# EasyEDA Pro project 有刷电调.epro

# Schematic Schematic3
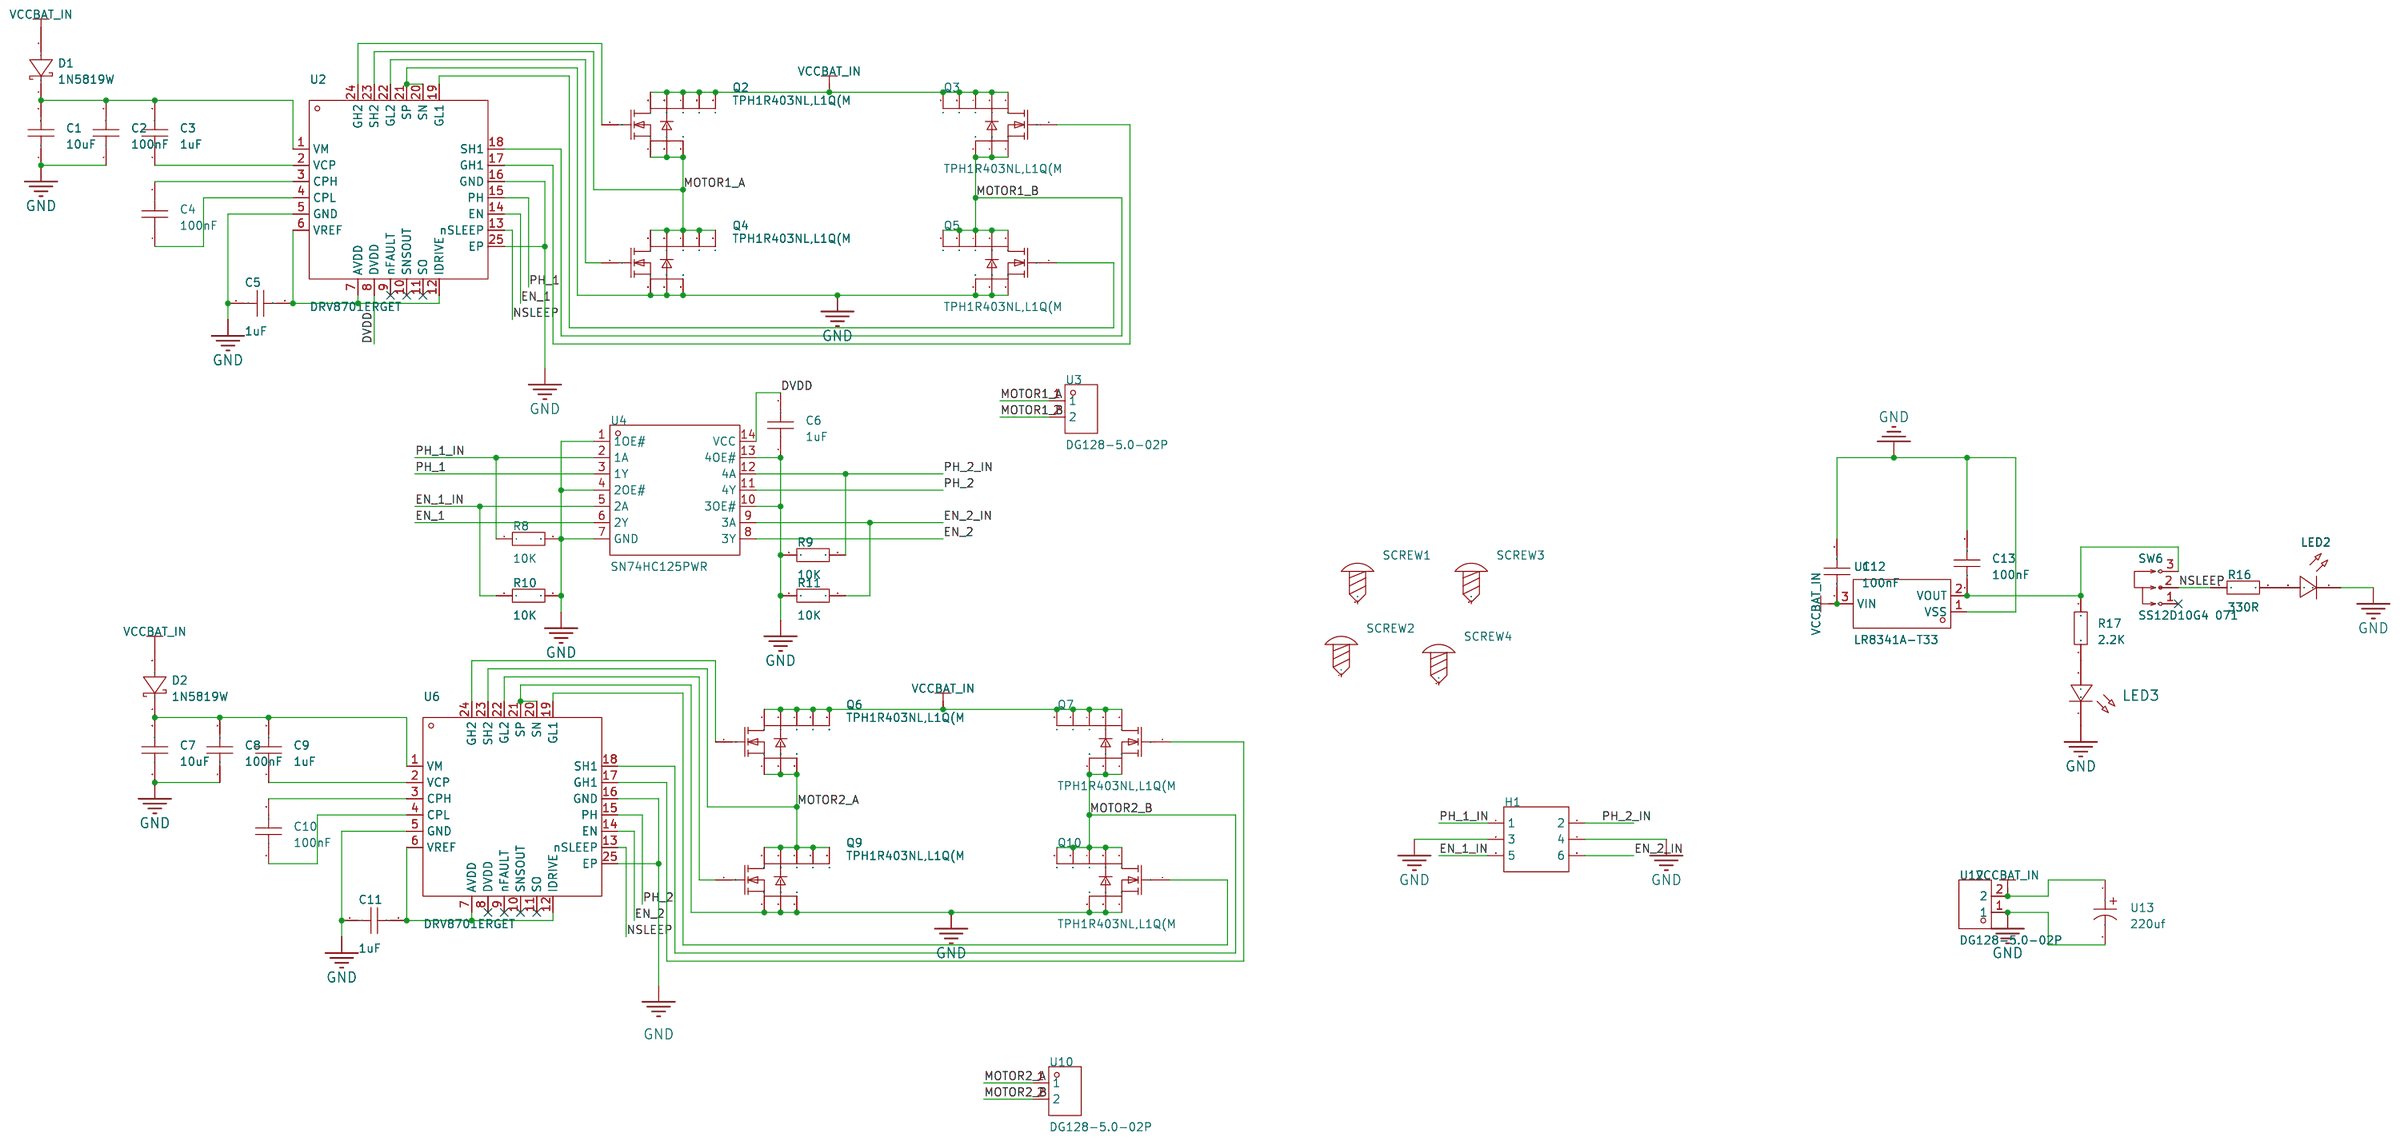
[diagram p0: schematic sheet]

## Parts
C1  10uF  [c0805]
C2  100nF  [C0603]
C3  1uF  [C0603]
C4  100nF  [C0603]
C5  1uF  [C0603]
C6  1uF  [C0603]
C7  10uF  [c0805]
C8  100nF  [C0603]
C9  1uF  [C0603]
C10  100nF  [C0603]
C11  1uF  [C0603]
C12  100nF  [C0603]
C13  100nF  [C0603]
D1  1N5819W  [SOD-123_L2.7-W1.6-LS3.7-RD-1]
D2  1N5819W  [SOD-123_L2.7-W1.6-LS3.7-RD-1]
H1  -  [HDR-TH_6P-P2.54-V-F-R2-C3-S2.54]
LED2  -  [LED_0603]
LED3  -  [LED_0603]
Q2  TPH1R403NL,L1Q(M  [DSOP-8_L5.0-W5.0-P1.27-LS6.0-BL-EP]
Q3  TPH1R403NL,L1Q(M  [DSOP-8_L5.0-W5.0-P1.27-LS6.0-BL-EP]
Q4  TPH1R403NL,L1Q(M  [DSOP-8_L5.0-W5.0-P1.27-LS6.0-BL-EP]
Q5  TPH1R403NL,L1Q(M  [DSOP-8_L5.0-W5.0-P1.27-LS6.0-BL-EP]
Q6  TPH1R403NL,L1Q(M  [DSOP-8_L5.0-W5.0-P1.27-LS6.0-BL-EP]
Q7  TPH1R403NL,L1Q(M  [DSOP-8_L5.0-W5.0-P1.27-LS6.0-BL-EP]
Q9  TPH1R403NL,L1Q(M  [DSOP-8_L5.0-W5.0-P1.27-LS6.0-BL-EP]
Q10  TPH1R403NL,L1Q(M  [DSOP-8_L5.0-W5.0-P1.27-LS6.0-BL-EP]
R8  10K  [R0603]
R9  10K  [R0603]
R10  10K  [R0603]
R11  10K  [R0603]
R16  330R  [R0603]
R17  2.2K  [R0603]
SCREW1  -  [M3螺丝]
SCREW2  -  [M3螺丝]
SCREW3  -  [M3螺丝]
SCREW4  -  [M3螺丝]
SW6  SS12D10G4 071  [SW-TH_SHOU-HAN_SS12D10G4]
U2  DRV8701ERGET  [VQFN-24_L4.0-W4.0-P0.50-BL-EP2.5]
U3  DG128-5.0-02P  [CONN-TH_XT30PW-M]
U4  SN74HC125PWR  [TSSOP-14_L5.0-W4.4-P0.65-LS6.5-BL]
U6  DRV8701ERGET  [VQFN-24_L4.0-W4.0-P0.50-BL-EP2.5]
U10  DG128-5.0-02P  [CONN-TH_XT30PW-M]
U11  LR8341A-T33  [SOT-23-3L_L2.9-W1.6-P1.90-LS2.8-BL]
U12  DG128-5.0-02P  [CONN-TH_XT30PW-M]
U13  220uf  [CAP-TH_BD6.3-P2.50-D0.5-FD]

## Library data of the parts
C1-C13 = CAP_0603: Supplier Footprint: 0603
D1 D2 = 1N5819W: 二极管配置:-;正向压降(Vf):900mV@3A;直流反向耐压(Vr):40V;平均整流电流(Io):1A;; LCSC Part Name: 电压:40V 电流:1A; Supplier Part: C2905650; Manufacturer: TECH PUBLIC(台舟); Supplier Footprint: SOD-123; JLCPCB Part Class: 扩展库; Datasheet: https://atta.szlcsc.com/upload/public/pdf/source/20211020/7FEA34DA99E5285CBA3CC87767B82BE7.pdf; Supplier: LCSC; Forward Voltage (Vf@If): 900mV@3A; Reverse Voltage (Vr): 40V; Average Rectified Current (Io): 1A; Reverse Leakage Current (Ir): 1mA@40V
H1 = HDR-F_2.54_2x3: Supplier Part: C92272; Supplier Footprint: 插件
LED2 = LED_0603-G: Supplier Footprint: 0603
LED3 = LED_0603-R: Supplier Footprint: 0603
Q2-Q7 Q9 Q10 = TPH1R403NL,L1Q(M: Supplier Part: C2940403; Manufacturer: TOSHIBA(东芝); Supplier Footprint: DFN-8(5x6); JLCPCB Part Class: 扩展库; Datasheet: https://atta.szlcsc.com/upload/public/pdf/source/20220830/C277A7BCA37DB7348B2C95BA2E6DA6BE.pdf; Supplier: LCSC
R8-R11 R16 R17 = Res_0603: Supplier Footprint: 0603
SCREW1-SCREW4 = M3螺丝: Supplier Footprint: 插件
SW6 = SS12D10G4 071: 电路结构:单刀双掷;安装方式:直插;开关颜色:-;额定电流(DC):2A;额定电压(DC):125V;额定电流(AC):-;额定电压(AC):-;机械寿命:3千次;; Supplier Part: C2887259; Manufacturer: SHOU HAN(首韩); Supplier Footprint: 插件; JLCPCB Part Class: 扩展库; Datasheet: https://atta.szlcsc.com/upload/public/pdf/source/20210820/80D1704BBF3FCEE0435FCAA54C61E0A3.pdf; Supplier: LCSC; Circuit: 单刀双掷; Pin Style: PC引脚; Switch Length: 12.7mm; Switch Width: 6.7mm; Switch Height: 6.4mm; Mounting Style: 直插; Current Rating (DC): 2A; Voltage Rating (DC): 125V; Mechanical Life: 3千次; Operating Temperature: -16℃~+60℃
U2 U6 = DRV8701ERGET: 驱动电机类型:有刷直流电机;电源电压:0V~5.5V;输出电流:-;接口:并行;; LCSC Part Name: 有刷直流电机驱动芯片 5.5V; Supplier Part: C132049; Manufacturer: TI(德州仪器); Supplier Footprint: VQFN-24(4x4); JLCPCB Part Class: 扩展库; Datasheet: https://www.ti.com/cn/lit/gpn/drv8701; Supplier: LCSC; Drive motor type: 有刷直流电机; Supply Voltage: 0V~5.5V; Interface: 并行; Operating Temperature: -40℃~+125℃@(Ta)
U3 U10 U12 = DG128-5.0-02P: 间距:5mm;排数:1;每排PIN数:2;安装方式:直针;额定电流:20A;额定电压:300V;线规 - AWG:12~30;线规 - mm?:2.5;工作温度范围:-40℃~+105℃;颜色:绿色;; LCSC Part Name: 5mm 排数:1 每排P数:2 直针; Manufacturer: DEGSON（高正/高松）; Manufacturer Part: DG128-5.0-02P-14-00A(H); Supplier Footprint: 直插,P=5mm; Datasheet: https://atta.szlcsc.com/upload/public/pdf/source/20200623/C691861_7A9C893F51DDD09CE6575068D5F90AE6.pdf; Supplier: LCSC-C711349; Pitch: 5mm; Number of Rows: 1; Number of PINs Per Row: 2; Mounting Style: 直针; Current Rating (Max): 20A; Voltage Rating (Max): 300V; Wire Gauge - AWG: 12~30; Wire Gauge - mm?: 2.5; Operating Temperature Range: -40℃~+105℃; Color: 绿色
U4 = SN74HC125PWR: 输入类型:-;电源电压:2V~6V;元件数:4;每个元件位数:1;灌电流(IOL):7.8mA;拉电流(IOH):7.8mA;; Supplier Part: C132994; Manufacturer: TI(德州仪器); Supplier Footprint: TSSOP-14; JLCPCB Part Class: 扩展库; Datasheet: https://www.ti.com/cn/lit/gpn/sn74hc125; Supplier: LCSC; output type: 三态; Supply Voltage: 2V~6V; Number of Elements: 4; Number of Bits per Element: 1; Sink Current: 7.8mA; Source Current: 7.8mA; Logic Family: 74HC; Operating Temperature: -40℃~+85℃
U11 = LR8341A-T33: 输出类型:固定;最大输入电压:40V;输出电压:3.3V;最大输出电流:100mA;电源纹波抑制比(PSRR):55dB@(1kHz);输出极性:正极;; LCSC Part Name: 输入40V 输出3.3V 100mA; Supplier Part: C2829465; Manufacturer: LR(朗瑞); Supplier Footprint: SOT-23-3L; JLCPCB Part Class: 扩展库; Datasheet: https://atta.szlcsc.com/upload/public/pdf/source/20210426/C2829465_61F15D7ACE9671B48D4F69A8092B0D8F.pdf; Supplier: LCSC; Output Type: 固定; Maximum Input Voltage: 40V; Output Voltage: 3.3V; MAX Output Current: 100mA; Power Supply Rejection Ratio (PSRR): 55dB@(1kHz); standby current: 2uA; Operating Temperature: -40℃~+85℃; Output Polarity: 正极; Number of Outputs: 1
U13 = 电解电容: Supplier Part: C9900022333; Supplier Footprint: CAP-TH; JLCPCB Part Class: 扩展库; Supplier: LCSC

## Nets
DVDD: C6.2 U2.8(DVDD) U4.14(VCC)
GND: C1.1 C2.1 C5.1 C6.1 C7.1 C8.1 C11.1 C12.2 C13.2 H1.3 H1.4 LED2.1(C) LED3.1(C) Q4.1(S) Q4.2(S) Q4.3(S) Q5.1(S) Q5.2(S) Q5.3(S) Q9.1(S) Q9.2(S) Q9.3(S) Q10.1(S) Q10.2(S) Q10.3(S) R8.2 R9.1 R10.2 R11.1 U2.5(GND) U2.16(GND) U2.20(SN) U2.21(SP) U2.25(EP) U4.1(1OE#) U4.4(2OE#) U4.7(GND) U4.10(3OE#) U4.13(4OE#) U6.5(GND) U6.16(GND) U6.20(SN) U6.21(SP) U6.25(EP) U11.1(VSS) U12.1 U13.2
VCCBAT_IN: C12.1 D1.2(A) D2.2(A) Q2.5(D) Q2.6(D) Q2.7(D) Q2.8(D) Q2.9(D) Q3.5(D) Q3.6(D) Q3.7(D) Q3.8(D) Q3.9(D) Q6.5(D) Q6.6(D) Q6.7(D) Q6.8(D) Q6.9(D) Q7.5(D) Q7.6(D) Q7.7(D) Q7.8(D) Q7.9(D) U11.3(VIN) U12.2 U13.1
EN_1: U2.14(EN) U4.6(2Y)
EN_1_IN: H1.5 R10.1 U4.5(2A)
EN_2: U4.8(3Y) U6.14(EN)
EN_2_IN: H1.6 R11.2 U4.9(3A)
MOTOR1_A: Q2.1(S) Q2.2(S) Q2.3(S) Q4.5(D) Q4.6(D) Q4.7(D) Q4.8(D) Q4.9(D) U2.23(SH2) U3.1
MOTOR1_B: Q3.1(S) Q3.2(S) Q3.3(S) Q5.5(D) Q5.6(D) Q5.7(D) Q5.8(D) Q5.9(D) U2.18(SH1) U3.2
MOTOR2_A: Q6.1(S) Q6.2(S) Q6.3(S) Q9.5(D) Q9.6(D) Q9.7(D) Q9.8(D) Q9.9(D) U6.23(SH2) U10.1
MOTOR2_B: Q7.1(S) Q7.2(S) Q7.3(S) Q10.5(D) Q10.6(D) Q10.7(D) Q10.8(D) Q10.9(D) U6.18(SH1) U10.2
NSLEEP: R16.1 SW6.2 U2.13(nSLEEP) U6.13(nSLEEP)
PH_1: U2.15(PH) U4.3(1Y)
PH_1_IN: H1.1 R8.1 U4.2(1A)
PH_2: U4.11(4Y) U6.15(PH)
PH_2_IN: H1.2 R9.2 U4.12(4A)
$1N1498: Q2.4(G) U2.24(GH2)
$1N1499: Q4.4(G) U2.22(GL2)
$1N1502: Q5.4(G) U2.19(GL1)
$1N1503: Q3.4(G) U2.17(GH1)
$1N1517: C5.2 U2.6(VREF) U2.7(AVDD) U2.12(IDRIVE)
$1N1519: C4.2 U2.3(CPH)
$1N1520: C4.1 U2.4(CPL)
$1N1521: C3.1 U2.2(VCP)
$1N1522: C1.2 C2.2 C3.2 D1.1(K) U2.1(VM)
$1N1525: Q6.4(G) U6.24(GH2)
$1N1526: Q9.4(G) U6.22(GL2)
$1N1529: Q10.4(G) U6.19(GL1)
$1N1530: Q7.4(G) U6.17(GH1)
$1N1542: C11.2 U6.6(VREF) U6.7(AVDD) U6.12(IDRIVE)
$1N1544: C10.2 U6.3(CPH)
$1N1545: C10.1 U6.4(CPL)
$1N1546: C9.1 U6.2(VCP)
$1N1547: C7.2 C8.2 C9.2 D2.1(K) U6.1(VM)
$1N1554: LED2.2(A) R16.2
$1N3369: C13.1 R17.2 SW6.3 U11.2(VOUT)
$1N3510: LED3.2(A) R17.1

Not connected (* = marked no-connect by the designer): SCREW1 1; SCREW2 1; SCREW3 1; SCREW4 1; SW6 1*; U2 9(nFAULT)* 10(SNSOUT)* 11(SO)*; U6 8(DVDD)* 9(nFAULT)* 10(SNSOUT)* 11(SO)*

# Board PCB3
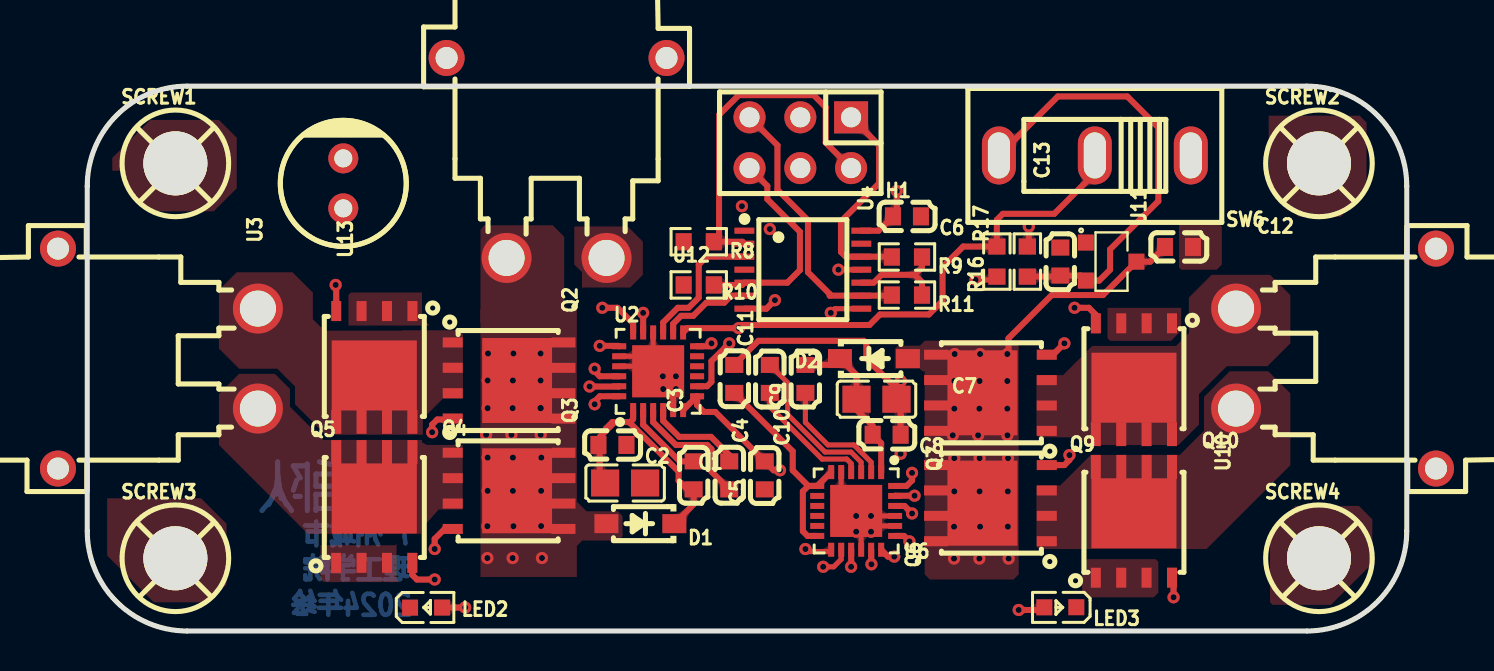
[diagram p1: board, top side]
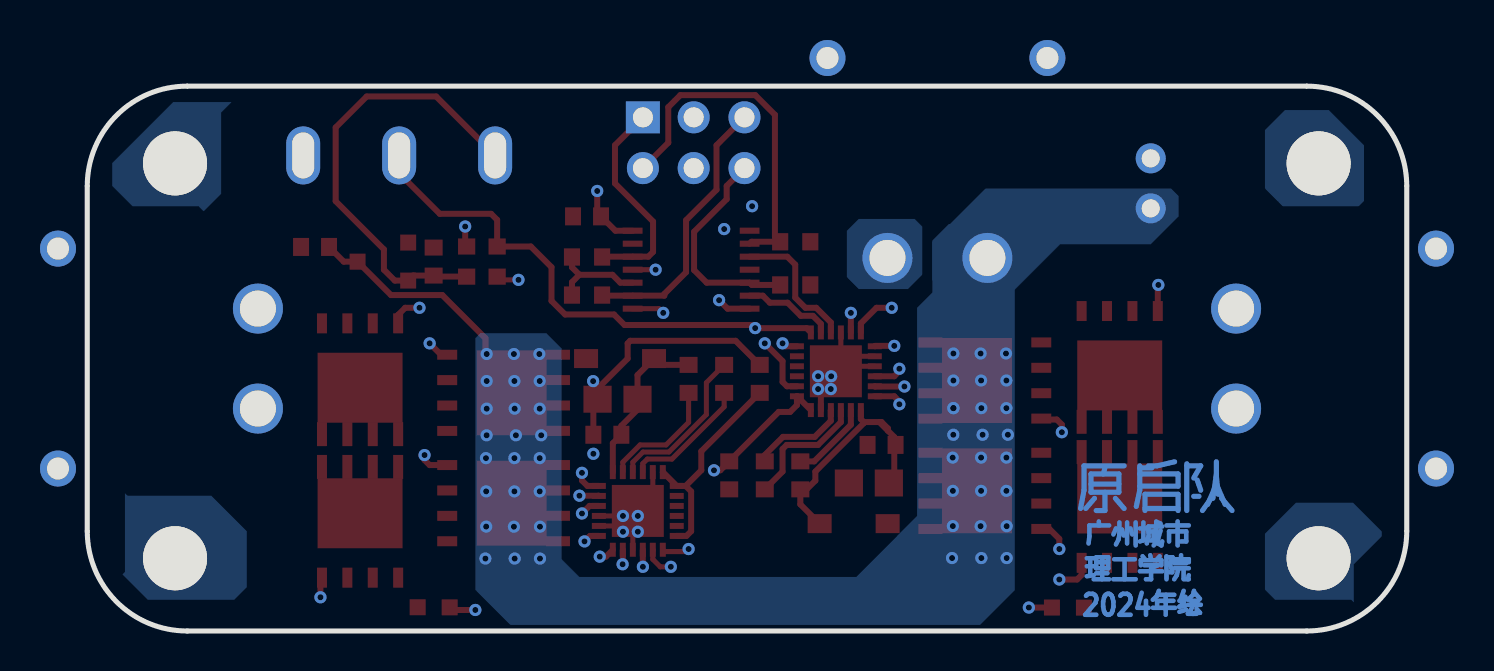
[diagram p2: board, bottom side, seen from below]

Outline 66 x 27.25 mm; copper layers: Top Layer, Inner1, Inner2, Bottom Layer. Coordinates in mm from the lower left corner of the outline.
Outline path: 0,22.25 0,5 arc(1.46,1.46) 5,0 61,0 arc(64.54,1.46) 66,5 66,22.25 arc(64.54,25.79) 61,27.25 5,27.25 arc(1.46,25.79) 0,22.25
Stack: Top Layer 0.035mm 外层铜厚1oz / Dielectric1 0.2104mm 7628 RC49% 8.6mil / Inner1 0.0152mm 内层铜厚 / Dielectric2 1.065mm 1.1mm H/HOZ 含铜 / Inner2 0.0152mm 内层铜厚 / Dielectric3 0.2104mm 7628 RC49% 8.6mil / Bottom Layer 0.035mm 外层铜厚1oz

## Design rules (mm)
template: JLCPCB Capability(Two Layers Board)
spacing copperThickness1oz (default): track to track 0.102, other pairs 0.152 to 0.3
spacing copperThickness2oz: track to track 0.203, other pairs 0.152 to 0.3
track width copperThickness1oz (default): min 0.127, default 0.254, max 2.54
track width copperThickness2oz: min 0.203, default 0.254, max 2.54
differential pair differentialPair (default): width min 0.127, default 0.254, max 2.54; gap min 0.152, default 0.152
via viaSize (default): diameter min 0.5, default 0.61, max 10; hole min 0.3, default 0.305, max 6.3

## Placement (name value [footprint] x y rotation side)
C1  10uF  [c0805]  26.9 7.4 180 top
C2  100nF  [C0603]  26.27 9.31 180 top
C3  1uF  [C0603]  30.33 7.78 270 top
C4  100nF  [C0603]  32.11 7.78 270 top
C5  1uF  [C0603]  33.89 7.78 90 top
C6  1uF  [C0603]  41 20.74 180 top
C7  10uF  [c0805]  39.48 11.59 180 top
C8  100nF  [C0603]  39.99 9.81 180 top
C9  1uF  [C0603]  35.92 12.61 90 top
C10  100nF  [C0603]  34.14 12.61 90 top
C11  1uF  [C0603]  32.37 12.61 270 top
C12  100nF  [C0603]  54.61 19.21 0 top
C13  100nF  [C0603]  48.67 18.48 90 top
D1  1N5819W  [SOD-123_L2.7-W1.6-LS3.7-RD-1]  27.67 5.37 180 top
D2  1N5819W  [SOD-123_L2.7-W1.6-LS3.7-RD-1]  39.35 13.62 0 top
H1  -  [HDR-TH_6P-P2.54-V-F-R2-C3-S2.54]  35.67 24.42 180 top
LED2  -  [LED_0603]  17 1.18 0 top
LED3  -  [LED_0603]  48.62 1.18 180 top
Q2  TPH1R403NL,L1Q(M  [DSOP-8_L5.0-W5.0-P1.27-LS6.0-BL-EP]  21.05 12.53 270 top
Q3  TPH1R403NL,L1Q(M  [DSOP-8_L5.0-W5.0-P1.27-LS6.0-BL-EP]  21.05 7.01 270 top
Q4  TPH1R403NL,L1Q(M  [DSOP-8_L5.0-W5.0-P1.27-LS6.0-BL-EP]  14.36 13.23 180 top
Q5  TPH1R403NL,L1Q(M  [DSOP-8_L5.0-W5.0-P1.27-LS6.0-BL-EP]  14.36 6.18 0 top
Q6  TPH1R403NL,L1Q(M  [DSOP-8_L5.0-W5.0-P1.27-LS6.0-BL-EP]  45.22 6.39 90 top
Q7  TPH1R403NL,L1Q(M  [DSOP-8_L5.0-W5.0-P1.27-LS6.0-BL-EP]  45.22 11.91 90 top
Q9  TPH1R403NL,L1Q(M  [DSOP-8_L5.0-W5.0-P1.27-LS6.0-BL-EP]  52.35 5.44 0 top
Q10  TPH1R403NL,L1Q(M  [DSOP-8_L5.0-W5.0-P1.27-LS6.0-BL-EP]  52.35 12.62 180 top
R8  10K  [R0603]  30.59 19.47 180 top
R9  10K  [R0603]  41 18.7 180 top
R10  10K  [R0603]  30.59 17.31 180 top
R11  10K  [R0603]  41 16.8 180 top
R16  330R  [R0603]  45.5 18.48 270 top
R17  2.2K  [R0603]  47.02 18.48 270 top
SCREW1  -  [M3螺丝]  4.47 23.32 0 top
SCREW2  -  [M3螺丝]  61.67 23.32 0 top
SCREW3  -  [M3螺丝]  4.47 3.57 0 top
SCREW4  -  [M3螺丝]  61.67 3.57 0 top
SW6  SS12D10G4 071  [SW-TH_SHOU-HAN_SS12D10G4]  50.4 23.78 180 top
U2  DRV8701ERGET  [VQFN-24_L4.0-W4.0-P0.50-BL-EP2.5]  28.56 12.99 0 top
U3  DG128-5.0-02P  [CONN-TH_XT30PW-M]  3.54 13.62 270 top
U4  SN74HC125PWR  [TSSOP-14_L5.0-W4.4-P0.65-LS6.5-BL]  35.79 18.07 270 top
U6  DRV8701ERGET  [VQFN-24_L4.0-W4.0-P0.50-BL-EP2.5]  38.46 6 180 top
U10  DG128-5.0-02P  [CONN-TH_XT30PW-M]  62.46 13.62 90 top
U11  LR8341A-T33  [SOT-23-3L_L2.9-W1.6-P1.90-LS2.8-BL]  51.21 18.48 270 top
U12  DG128-5.0-02P  [CONN-TH_XT30PW-M]  23.47 23.66 180 top
U13  220uf  [CAP-TH_BD6.3-P2.50-D0.5-FD]  12.81 22.39 90 top

## Footprints (pads in the part's own frame, mm; a bottom-side part is the same pattern mirrored in y, then rotated)
C0603
  rect 0.8x0.9 smd: 1(-0.7,0) 2(0.7,0)
c0805
  rect 1.41x1.35 smd: 1(-1,0) 2(1,0)
CAP-TH_BD6.3-P2.50-D0.5-FD
  round 1.5 hole 0.9: 1(-1.25,0) 2(1.25,0)
CONN-TH_XT30PW-M
  round 2.5 hole 1.8: 1(-2.5,5) 2(2.5,5)
  round 1.8 hole 1.1: 3(5.5,-5) 4(-5.5,-5)
DSOP-8_L5.0-W5.0-P1.27-LS6.0-BL-EP
  rect 0.5x1 smd: 1(-1.905,-2.77) 2(-0.635,-2.77) 3(0.634,-2.77) 4(1.905,-2.77)
  rect 0.5x1.2 smd: 5(1.905,2.77) 6(0.635,2.77) 7(-0.634,2.77) 8(-1.905,2.77)
  custom 4.25x3.5 smd: 9(0,0.45)
HDR-TH_6P-P2.54-V-F-R2-C3-S2.54
  rect 1.7x1.6 hole 1: 1(-2.54,-1.27)
  round 1.6 hole 1: 2(-2.54,1.27) 3(0,-1.27) 4(0,1.27) 5(2.54,-1.27) 6(2.54,1.27)
LED_0603
  rect 0.8x0.8 smd: 1(-0.851,-0.01) 2(0.75,-0.005)
M3螺丝
  round 3.2 hole 3.2: 1(-0.064,0.064)
R0603
  rect 0.806x0.864 smd: 1(-0.753,0) 2(0.753,0)
SOD-123_L2.7-W1.6-LS3.7-RD-1
  rect 1.2x0.95 smd: 1(-1.7,0) 2(1.7,0)
SOT-23-3L_L2.9-W1.6-P1.90-LS2.8-BL
  rect 0.8x0.8 smd: 1(-0.95,-1.265) 2(0.95,-1.265) 3(0.005,1.265)
SW-TH_SHOU-HAN_SS12D10G4
  oval 1.7x2.9 hole 1.1x2.3: 1(-4.8,0) 2(0,0) 3(4.8,0)
TSSOP-14_L5.0-W4.4-P0.65-LS6.5-BL
  rect 0.305x0.991 smd: 1(-1.95,-2.925) 2(-1.3,-2.925) 3(-0.65,-2.925) 4(0,-2.925) 5(0.65,-2.925) 6(1.3,-2.925) 7(1.95,-2.925) 8(1.95,2.925) 9(1.3,2.925) 10(0.65,2.925) 11(0,2.925) 12(-0.65,2.925) 13(-1.3,2.925) 14(-1.95,2.925)
VQFN-24_L4.0-W4.0-P0.50-BL-EP2.5
  rect 0.3x0.7 smd: 1(-1.25,-1.942) 2(-0.75,-1.942) 3(-0.25,-1.942) 4(0.25,-1.942) 5(0.75,-1.942) 6(1.25,-1.942) 13(1.25,1.942) 14(0.75,1.942) 15(0.25,1.942) 16(-0.25,1.942) 17(-0.75,1.942) 18(-1.25,1.942)
  rect 0.7x0.3 smd: 7(1.948,-1.25) 8(1.948,-0.75) 9(1.948,-0.25) 10(1.948,0.25) 11(1.948,0.75) 12(1.948,1.25) 19(-1.948,1.25) 20(-1.948,0.75) 21(-1.948,0.25) 22(-1.948,-0.25) 23(-1.948,-0.75) 24(-1.948,-1.25)
  rect 2.6x2.6 smd: 25(0.001,-0.001)

## Nets
As in the schematic, except:
GND: C1.1 C2.1 C5.1 C6.1 C7.1 C8.1 C11.1 C12.2 C13.2 H1.3 H1.4 LED2.1 LED3.1 Q4.1 Q4.2 Q4.3 Q5.1 Q5.2 Q5.3 Q9.1 Q9.2 Q9.3 Q10.1 Q10.2 Q10.3 R8.2 R9.1 R10.2 R11.1 SCREW1.1 SCREW2.1 SCREW3.1 SCREW4.1 U2.5 U2.16 U2.20 U2.21 U2.25 U4.1 U4.4 U4.7 U4.10 U4.13 U6.5 U6.16 U6.20 U6.21 U6.25 U11.1 U12.1 U13.2
EN_1_IN: H1.6 R10.1 U4.5
EN_2_IN: H1.5 R11.2 U4.9
PH_1_IN: H1.2 R8.1 U4.2
PH_2_IN: H1.1 R9.2 U4.12

Pads without a net: SW6 1; U2 9 10 11; U3 3 4; U6 8 9 10 11; U10 3 4; U12 3 4

## Via types
v1: diameter 0.61, hole 0.305, Top Layer to Bottom Layer, 96 vias

## Routing (per net, layer and track width the routed paths; a pad name or vN(x,y) marks a point on that pad's centre or on a via; arc(x,y) is an arc through that point)
DVDD: length 19.9
  Top Layer w0.3: U4.14 39.58,20.02 40.49,20.93 v1(40.49,22.01) ; U2.8 31,12.24 31.22,12.46 31.22,13.5 v1(32.11,14.39)
  Inner1 w0.3: v1(32.11,14.39) 31.6,14.89 31.6,15.91 35.79,20.1 39.35,20.1 40.49,21.25 v1(40.49,22.01)
GND: length 35
  Top Layer w0.254: 38.71,5.75 U6.25 37.71,6.75 U6.5 ; 38.71,5.75 v1(39.2,5.75) 40.41,5.75 ; 38.71,5.75 39.21,5.25 40.41,5.25 ; 38.71,5.75 U6.16 ; U2.20 27.81,13.74 28.31,13.24 ; 28.31,13.24 U2.25 ; 28.31,13.24 28.31,14.93 ; 28.31,13.24 U2.21
  Top Layer w0.3: C8.1 40.69,11.39 C7.1 40.48,12.12 38.97,13.62 38.97,14.39 38.84,14.51 33.57,14.51 C11.1 ; U2.5 29.31,12.24 U2.25 ; 32.87,16.12 33.97,16.12 v1(34.4,16.55) ; R9.1 41.75,18.19 41.38,17.82 ; 41.38,17.82 39.73,17.82 39.34,17.42 38.72,17.42 ; 41.38,17.82 41.75,17.44 R11.1
  vias: v1(28.79,12.74) v1(28.81,12.1) v1(29.44,12.74) v1(29.44,12.1) v1(32.75,21.25) v1(34.14,20.1) v1(38.46,5.75) v1(38.46,4.97) v1(39.2,4.97) v1(40.7,12.5) v1(40.69,8.86)
VCCBAT_IN: length 13
  Top Layer w0.3: Q7.9 46.08,13.22 46.08,14.64 48.24,16.8 50.81,16.8 U11.3 53.17,18.47 C12.1
  vias: v1(20.05,13.88) v1(20.03,12.53) v1(20.03,11.15) v1(19.95,9.81) v1(20.03,8.67) v1(20.03,7.01) v1(20.01,5.24) v1(20.01,3.65) v1(21.22,9.81) v1(21.32,13.88) v1(21.29,12.53) v1(21.28,11.15) v1(21.29,8.67) v1(21.29,7.01) v1(21.32,5.24) v1(21.28,3.65) v1(22.68,13.88) v1(22.68,12.53) v1(22.68,11.15) v1(22.68,11.15) v1(22.68,9.81) v1(22.71,8.67) v1(22.7,7.01) v1(22.7,5.25) v1(22.74,3.65) v1(43.29,9.79) v1(43.39,13.85) v1(43.37,12.5) v1(43.37,11.12) v1(43.37,8.65) v1(43.37,6.98) v1(43.36,5.22) v1(43.36,3.62) v1(44.63,12.5) v1(44.62,11.12) v1(44.56,9.79) v1(44.63,8.65) v1(44.63,6.98) v1(44.62,3.62) v1(44.66,13.85) v1(44.66,5.22) v1(46.02,13.85) v1(46.02,12.5) v1(46.02,11.12) v1(46.02,9.79) v1(46.05,6.98) v1(46.05,5.22) v1(46.06,8.65) v1(46.09,3.62)
EN_1: length 4.6
  Top Layer w0.3: U4.6 32.21,16.77 31.86,16.42 30.97,16.42 30.31,15.76 29.7,15.76 29.31,15.36 29.31,14.93
EN_1_IN: length 10.8
  Top Layer w0.3: H1.6 34.02,22.26 34.02,21.6 35.65,19.97 35.65,18.05 35.02,17.42 32.87,17.42 32.76,17.31 R10.1
EN_2: length 16.3
  Top Layer w0.254: 38.72,16.12 37.4,16.12 v1(37.19,15.91) ; 37.7,4.05 U6.14 37.71,3.59 37.34,3.21 v1(36.81,3.21)
  Inner1 w0.254: v1(37.19,15.91) 36.51,15.23 36.51,3.52 v1(36.81,3.21)
EN_2_IN: length 13.7
  Top Layer w0.3: R11.2 40.22,16.77 U4.9 37.14,16.77 37.14,16.86 36.05,17.94 36.05,20.54 34.52,22.07 34.52,24.29 H1.5
MOTOR1_A: length 32.1
  Top Layer w0.3: U2.23 26.59,12.23 v1(25.13,12.23)
  Inner2 w0.5: v1(25.13,12.23) 24.36,12.99 24.36,14.72 24.06,15.02 18.65,15.02 12.68,9.05 7.4,9.05 6.58,9.87 6.58,14.17 U3.1
MOTOR1_B: length 21.6
  Top Layer w0.3: v1(25.76,16.17) 26.52,16.17 27.31,15.38 27.31,14.93
  Inner2 w0.5: v1(25.76,16.17) 16.62,16.17 11.58,11.12 U3.2
MOTOR2_A: length 39.6
  Top Layer w0.3: 40.41,6.75 40.42,6.77 v1(41.38,6.77)
  Inner2 w0.5: U10.1 57.63,10.96 58.62,10.96 59.12,11.46 59.12,17.28 58.62,17.78 56.78,17.78 55,16 55,10.36 47.35,2.7 42.53,2.7 42.14,3.08 42.14,6 v1(41.38,6.77)
MOTOR2_B: length 26.9
  Top Layer w0.3: U6.18 40.06,3.72 v1(40.37,3.72)
  Inner2 w0.5: U10.2 55.61,14.27 55.61,10.11 47.44,1.94 42.14,1.94 v1(40.37,3.72)
NSLEEP: length 40.3
  Top Layer w0.254: U6.13 37.12,3.97 36.05,3.97
  Top Layer w0.3: 29.81,14.93 30.02,15.15 v1(32.59,15.15) 32.75,15.3 39.12,15.3 39.65,15.83 42.1,15.83 42.78,16.51 42.78,18.2 43.81,19.23 R16.1 45.5,20.56 45.8,20.86 48.37,20.86 50.4,22.9 SW6.2
  Inner1 w0.254: 32.49,15.15 32.62,15.15 35.92,11.85 v1(35.92,4.1)
PH_1: length 6.9
  Top Layer w0.3: 28.81,14.93 28.81,15.43 29.54,16.17 30.08,16.17 30.59,16.67 30.59,18.32 30.98,18.72 U4.3
PH_1_IN: length 17.6
  Top Layer w0.3: H1.2 36.94,24.42 36.94,26.2 36.34,26.8 32.59,26.8 31.6,25.82 31.6,19.73 R8.1 32.77,19.47 U4.2
PH_2: length 17.9
  Top Layer w0.254: U4.11 v1(37.57,18.07)
  Top Layer w0.3: v1(38.21,3.21) 38.21,3.22 U6.15
  Inner1 w0.254: v1(37.57,18.07) 37.83,17.82 37.83,15.26 36.94,14.37 36.94,4.48 v1(38.21,3.21)
PH_2_IN: length 10.8
  Top Layer w0.3: H1.1 39.6,24.29 39.6,22.39 37.7,20.48 37.7,18.96 37.94,18.72 U4.12 40.23,18.72 R9.2
$1N1498: length 37.8
  Top Layer w0.3: v1(17.25,9.94) 17.25,10.32 17.51,10.58 18.23,10.58 18.28,10.62 ; v1(25.38,11.34) 25.38,11.49 25.63,11.74 U2.24
  Inner1 w0.3: v1(25.38,11.34) 25.38,11.62 29.21,15.45 29.21,20.21 27.03,22.39 19.54,22.39 18.05,20.9 18.05,10.16 17.83,9.94 v1(17.25,9.94)
$1N1499: length 45.5
  Top Layer w0.3: U2.22 25.63,12.74 25.38,12.99 v1(25.38,13.12) ; v1(12.43,17.31) 12.45,17.28 12.45,16
  Inner1 w0.3: v1(12.43,17.31) 16.49,13.24 16.49,9.84 17.16,9.18 17.63,9.18 18.45,10 18.45,20.73 19.7,21.99 26.87,21.99 28.81,20.04 28.81,16.06 25.87,13.12 v1(25.38,13.12)
$1N1502: length 37.5
  Top Layer w0.3: Q5.4 16.26,2.8 16.49,2.58 v1(17.38,2.58) ; U2.19 26.59,14.26 v1(25.63,14.26)
  Inner1 w0.3: v1(25.63,14.26) 25.63,14.68 28.01,17.06 28.01,19.71 26.53,21.18 20.04,21.18 19.25,20.4 19.25,4.45 v1(17.38,2.58)
$1N1503: length 34.6
  Top Layer w0.3: v1(17.38,4.1) 17.38,4.61 17.88,5.11 18.28,5.11 ; 27.81,14.93 v1(27.81,15.91)
  Inner1 w0.3: v1(27.81,15.91) 28.41,16.51 28.41,19.88 26.7,21.59 19.87,21.59 18.85,20.56 18.85,9.83 17.38,8.36 v1(17.38,4.1)
$1N1517: length 15.6
  Top Layer w0.3: U2.6 30.5,11.74 U2.7 30.5,11.3 30.84,10.96 31.41,10.96 C5.2 34.34,8.04 v1(34.65,8.04) ; v1(31.22,14.39) 31.07,14.24 U2.12
  Inner1 w0.3: v1(34.65,8.04) 34.4,8.04 31.22,11.21 v1(31.22,14.39)
$1N1519: length 6.5
  Top Layer w0.3: C4.2 31.22,7.97 31.22,9.1 31.01,9.31 29.44,9.31 28.31,10.45 U2.3
$1N1520: length 4.9
  Top Layer w0.3: C4.1 32.11,8.8 31.2,9.71 29.61,9.71 28.81,10.51 28.81,11.04 U2.4
$1N1521: length 4
  Top Layer w0.3: U2.2 27.81,10.32 29.64,8.48 C3.1
$1N1522: length 12.8
  Top Layer w0.3: 25.95,10.02 26.38,10.45 ; 25.95,10.02 25.95,10.13 26.27,10.45 26.38,10.45 ; 25.95,10.02 25.63,9.7 25.63,7.66 25.89,7.4 26.16,7.4 ; 26.38,10.45 27.16,10.45 ; D1.1 30.33,6.34 C3.2 30.02,7.08 29.58,7.52 29.58,7.97 27.16,10.4 27.16,10.45 ; 27.16,10.45 27.31,10.6 U2.1
$1N1525: length 26.5
  Top Layer w0.3: v1(41.25,7.91) 41.25,7.53 40.98,7.25 40.41,7.25 ; v1(49.13,8.8) 49.13,8.55 48.88,8.3 Q6.4
  Inner1 w0.3: v1(41.25,7.91) 39.5,7.91 38.52,8.89 38.52,12.24 41.85,15.57 46.42,15.57 47.88,14.12 47.88,10.34 49.13,9.09 v1(49.13,8.8)
$1N1526: length 39
  Top Layer w0.3: v1(54.34,1.69) 54.34,2.59 Q9.4 ; v1(41.25,5.88) 40.88,6.25 40.41,6.25
  Inner1 w0.3: v1(54.34,1.69) 51.67,1.69 49.76,3.59 49.76,9.02 48.28,10.51 48.28,14.28 46.59,15.97 41.69,15.97 38.12,12.4 38.12,8.72 40.96,5.88 v1(41.25,5.88)
$1N1529: length 25.3
  Top Layer w0.3: v1(41.13,4.48) 40.85,4.75 40.41,4.75 ; Q10.4 50.45,15.81 50.1,16.17 v1(49.38,16.17)
  Inner1 w0.3: v1(49.38,16.17) 49.18,16.37 41.52,16.37 37.72,12.57 37.72,8.56 41.13,5.15 v1(41.13,4.48)
$1N1530: length 29.2
  Top Layer w0.3: v1(48.88,14.39) 48.31,13.82 Q7.4 ; v1(39.22,3.34) 39.21,3.35 U6.17
  Inner1 w0.3: v1(48.88,14.39) 49.99,15.5 49.99,16.42 49.63,16.77 41.35,16.77 37.32,12.73 37.32,4.96 38.94,3.34 v1(39.22,3.34)
$1N1542: length 10.8
  Top Layer w0.3: U6.12 36.03,4.75 35.79,4.99 35.79,6.98 36.07,7.25 ; 36.07,7.25 U6.7 37.2,7.95 U6.6 ; 36.07,7.25 35.29,8.04 35.29,8.99 C11.2
$1N1544: length 8
  Top Layer w0.25: C10.2 35.03,12.42 35.03,10.82 36.9,8.95 38.2,8.95 38.71,8.44 U6.3
$1N1545: length 6.4
  Top Layer w0.254: C10.1 34.14,11.21 36.76,8.6 37.99,8.6 38.21,8.37 U6.4
$1N1546: length 6.1
  Top Layer w0.254: U6.2 39.21,8.44 38.35,9.31 37.05,9.31 35.92,10.43 C9.1
$1N1547: length 8.4
  Top Layer w0.25: D2.1 37.33,13.31
  Top Layer w0.3: D2.1 38.48,12.8 C7.2 38.48,11.07 39.28,10.26 39.28,9.81 39.71,9.39 U6.1 ; 37.33,13.31 C9.2
$1N1554: length 34.6
  Top Layer w0.254: R16.2 45.34,17.56 v1(44.43,17.56)
  Top Layer w0.3: LED2.2 v1(18.9,1.17)
  Inner2 w0.3: v1(44.43,17.56) 40.24,17.56 23.85,1.17 v1(18.9,1.17)
$1N3369: length 22.4
  Top Layer w0.3: SW6.3 48.55,26.73 52.02,26.73 53.57,25.18 53.57,21.5 51.16,19.09 51.16,18.07 50.62,17.53 U11.2 49.7,17.78 C13.1 48.62,17.72 R17.2
$1N3510: length 42
  Top Layer w0.3: LED3.2 47.74,1.05 v1(46.59,1.05) ; R17.1 47.1,19.3 v1(47.1,20.23) 46.97,20.36
  Inner2 w0.3: v1(46.59,1.05) 36.68,1.05 33,4.73 33,8.29 40.75,16.04 45.8,16.04 47.1,17.33 v1(47.1,20.23)

## Copper pours and planes (outline as drawn; the poured copper is in the pictures)
GND on Top Layer: 24.35,20.23 27.79,20.23 27.79,17.18 24.35,17.18
GND on Top Layer: 13.06,16.93 17.12,16.93 17.12,15.28 13.06,15.28
GND on Top Layer: 59.16,6.26 64.28,6.26 64.28,1.31 59.16,1.31
GND on Top Layer: 59.1,25.77 64.12,25.77 64.12,20.72 59.1,20.72
GND on Top Layer: 54.61,20.44 56.75,20.44 56.75,18.07 54.61,18.07
GND on Top Layer: 1.25,25.56 7.47,25.56 7.47,20.99 1.25,20.99
GND on Top Layer: 49.76,3.59 53.57,3.59 53.57,1.69 49.76,1.69
GND on Top Layer: 1,6.64 6.97,6.64 6.97,1.43 1,1.43
GND on Top Layer: 51.03,16.17 54.72,16.17 54.72,14.51 51.03,14.51
GND on Top Layer: 11.66,4.35 15.6,4.35 15.6,2.45 11.66,2.45
GND on Top Layer: -15.51,38.52 79.35,38.52 79.35,-11.01 -15.51,-11.01
GND on Bottom Layer: 58.02,6.89 64.24,6.89 64.24,1.56 58.02,1.56
GND on Bottom Layer: 1.25,6.42 7.09,6.42 7.09,1.43 1.25,1.43
GND on Bottom Layer: 58.78,26.45 64.75,26.45 64.75,20.99 58.78,20.99
GND on Bottom Layer: 24.24,20.61 28.01,20.61 28.01,17.1 24.24,17.1
GND on Bottom Layer: 2.14,26.05 7.09,26.05 7.09,21.25 2.14,21.25
GND on Bottom Layer: -10.05,34.83 75.29,34.83 75.29,-6.69 -10.05,-6.69
GND on Inner1: -17.17,41.56 92.06,41.56 92.06,-14.7 -17.17,-14.7
GND on Inner2: -22.75,45.12 101.96,45.12 101.96,-21.3 -22.75,-21.3
VCCBAT_IN on Top Layer: 40.39,14.51 43.06,14.51 43.06,12.99 40.39,12.99
VCCBAT_IN on Top Layer: 19.66,16.09 26.78,16.09 26.78,2.7 19.66,2.7
VCCBAT_IN on Top Layer: 41.89,14.51 46.59,14.51 46.59,2.58 41.89,2.58
VCCBAT_IN on Top Layer: 19.66,20.29 24.49,20.29 24.49,15.4 19.66,15.4
VCCBAT_IN on Bottom Layer: 19.61,20.36 46.59,20.36 46.59,0.31 19.61,0.31
VCCBAT_IN on Bottom Layer: 11.41,22.13 23.73,22.13 23.73,16.8 11.41,16.8
MOTOR1_A on Top Layer: 15.78,15.04 18.79,15.04 18.79,9.94 15.78,9.94
MOTOR1_A on Top Layer: 6.58,17.94 16.79,17.94 16.79,9.81 6.58,9.81
MOTOR1_B on Top Layer: 6.58,12.86 16.74,12.86 16.74,4.86 6.58,4.86
MOTOR1_B on Top Layer: 16.51,9.55 18.78,9.55 18.78,4.87 16.51,4.87
MOTOR2_A on Top Layer: 47.48,12.99 60.18,12.99 60.18,4.1 47.48,4.1
MOTOR2_B on Top Layer: 47.48,17.82 60.18,17.82 60.18,9.31 47.48,9.31

Small or netless copper shapes (teardrops, artwork), in the pictures only: 152 on Top Layer, 22 on Inner1, 8 on Inner2

## Text on the board
Bottom Layer: 广州城市 / 理工学院 | 2024年绘 | 原启队
